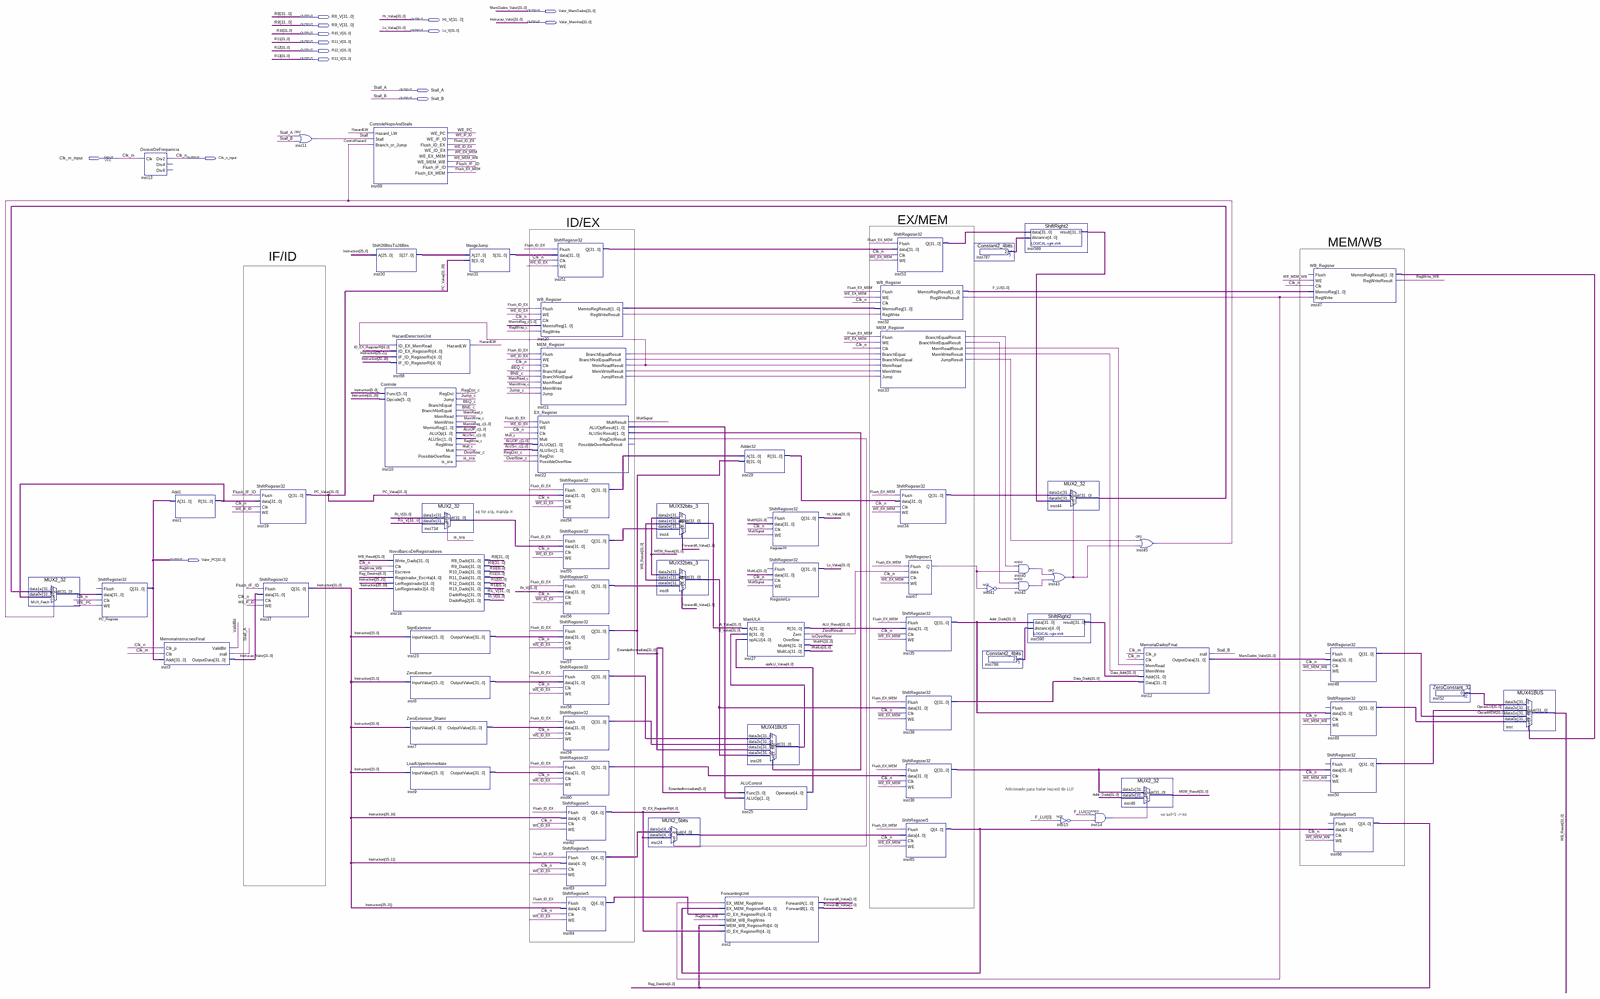
[diagram p0: schematic sheet, whole]
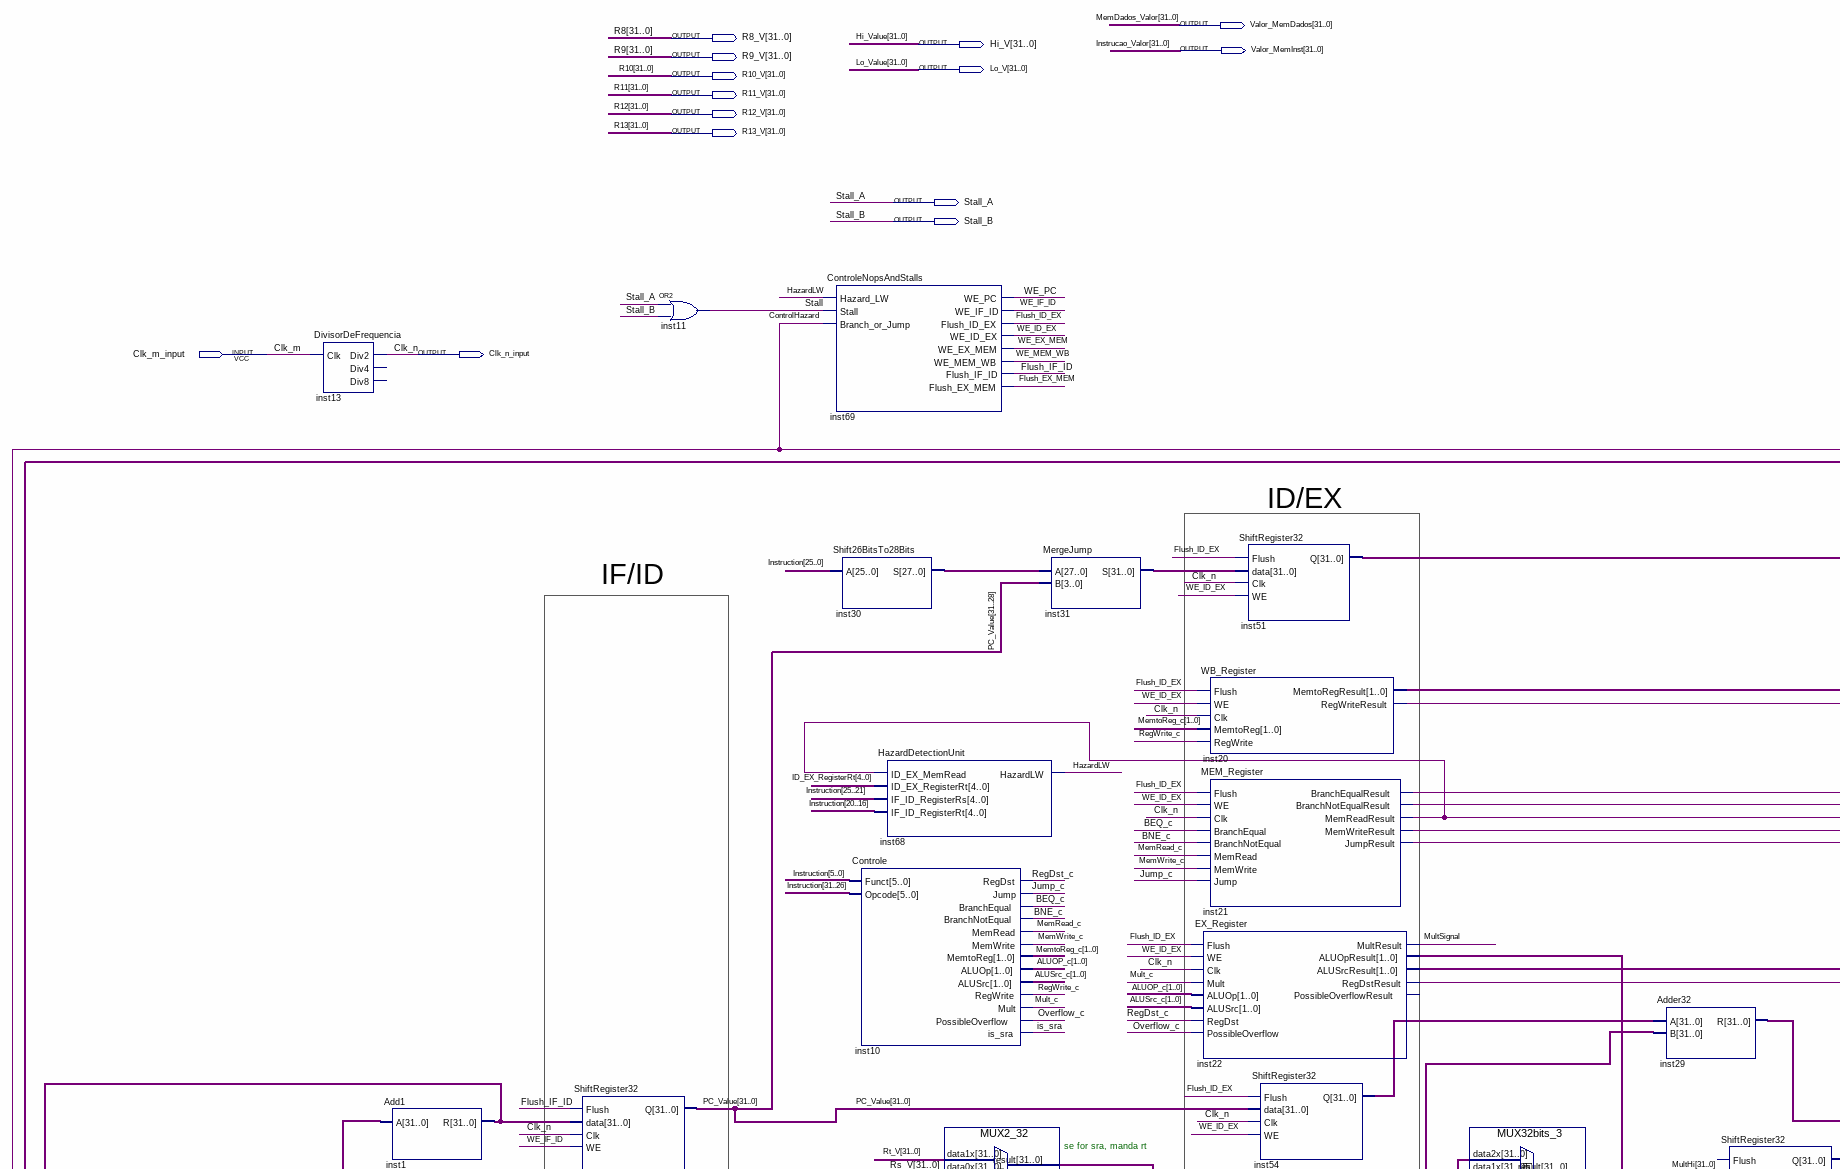
[diagram p1: schematic sheet, upper left part]
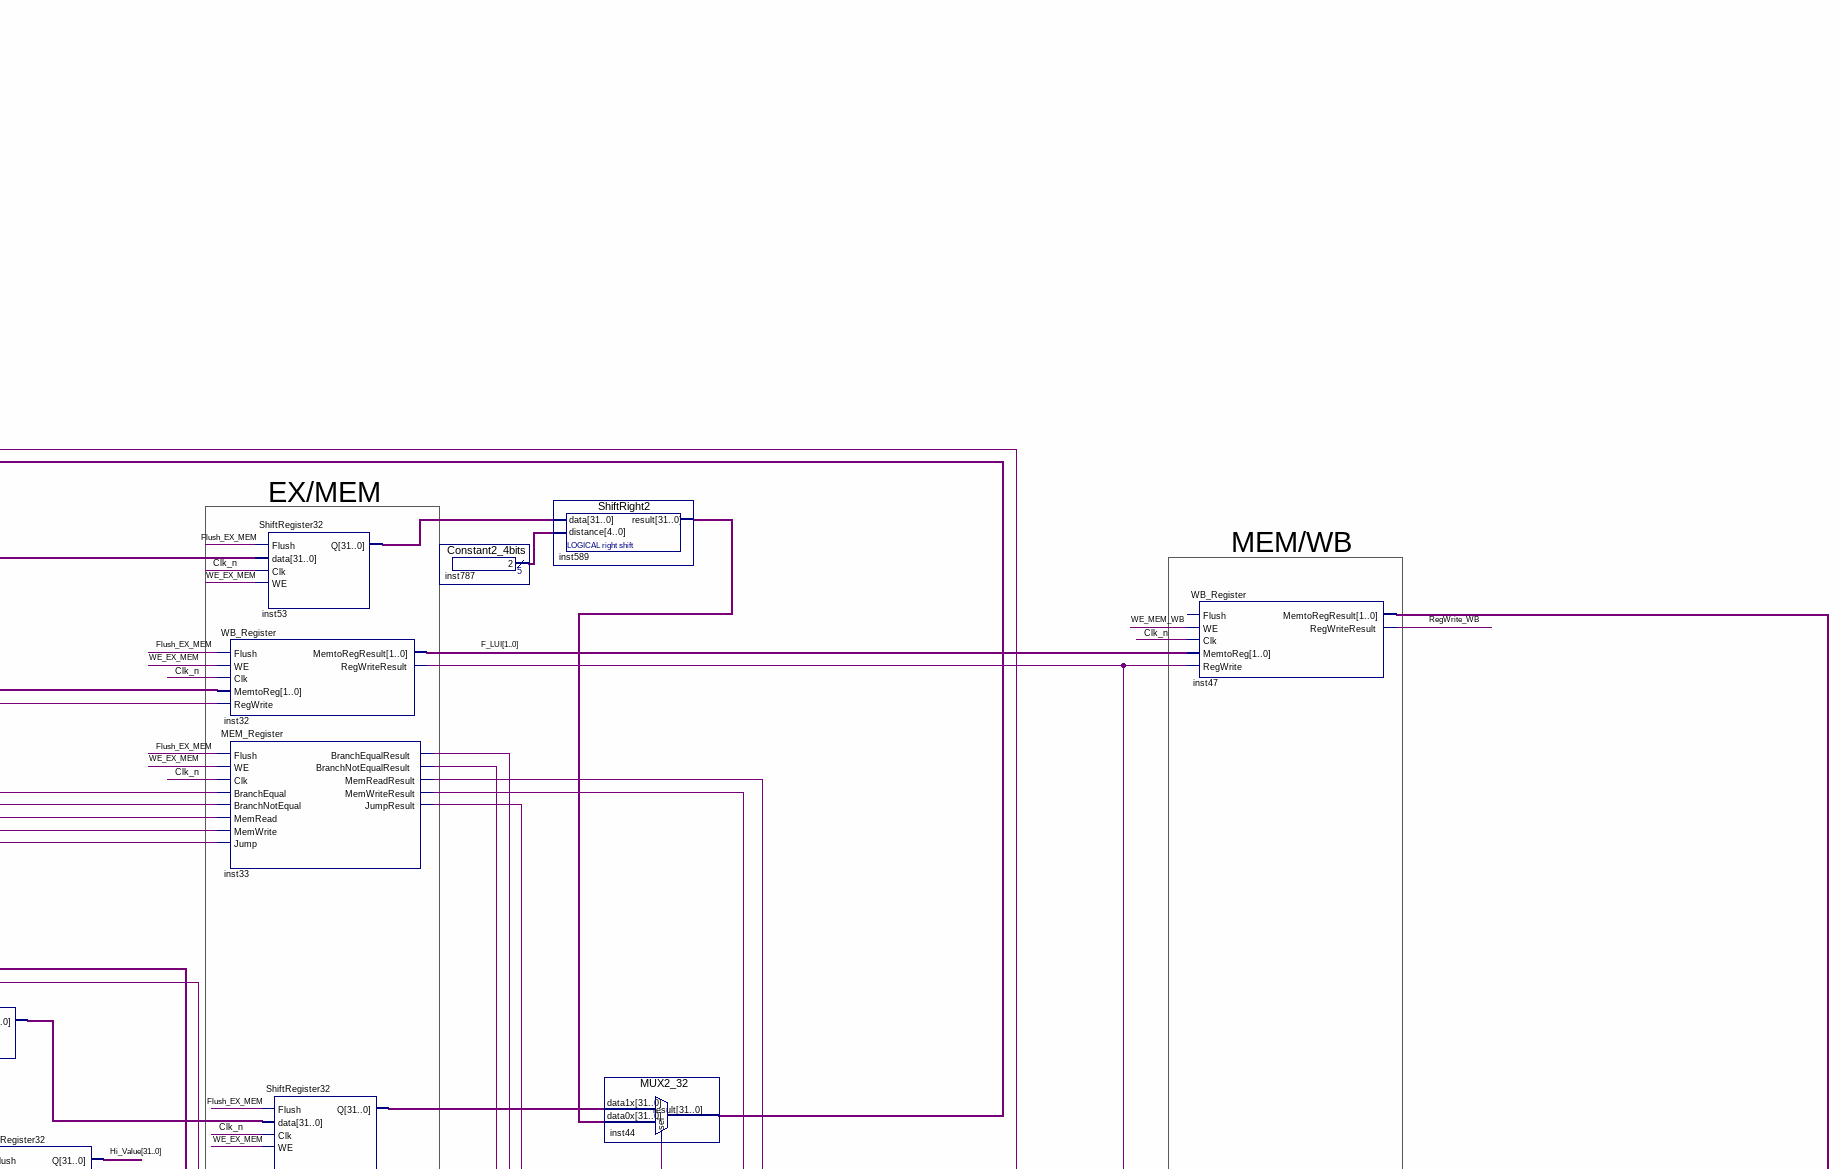
[diagram p2: schematic sheet, upper right part]
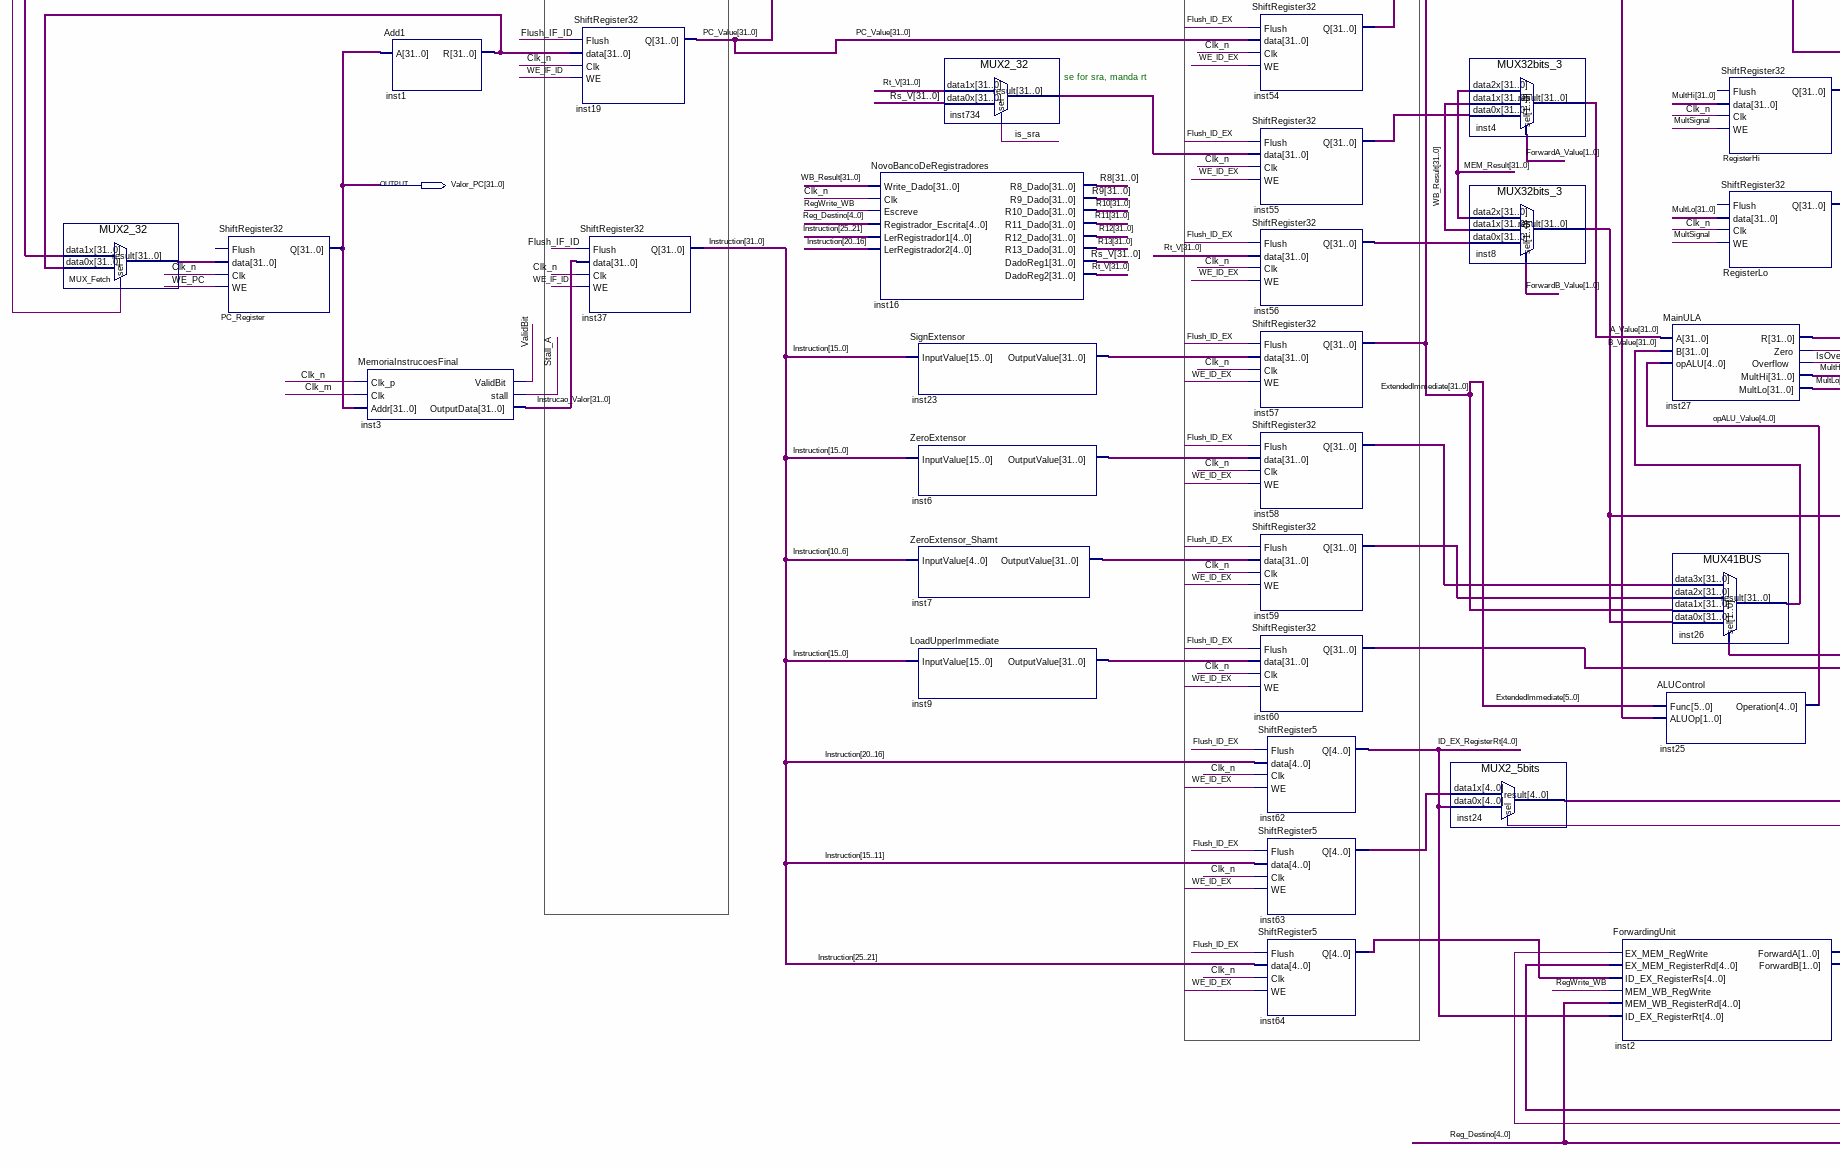
[diagram p3: schematic sheet, lower left part]
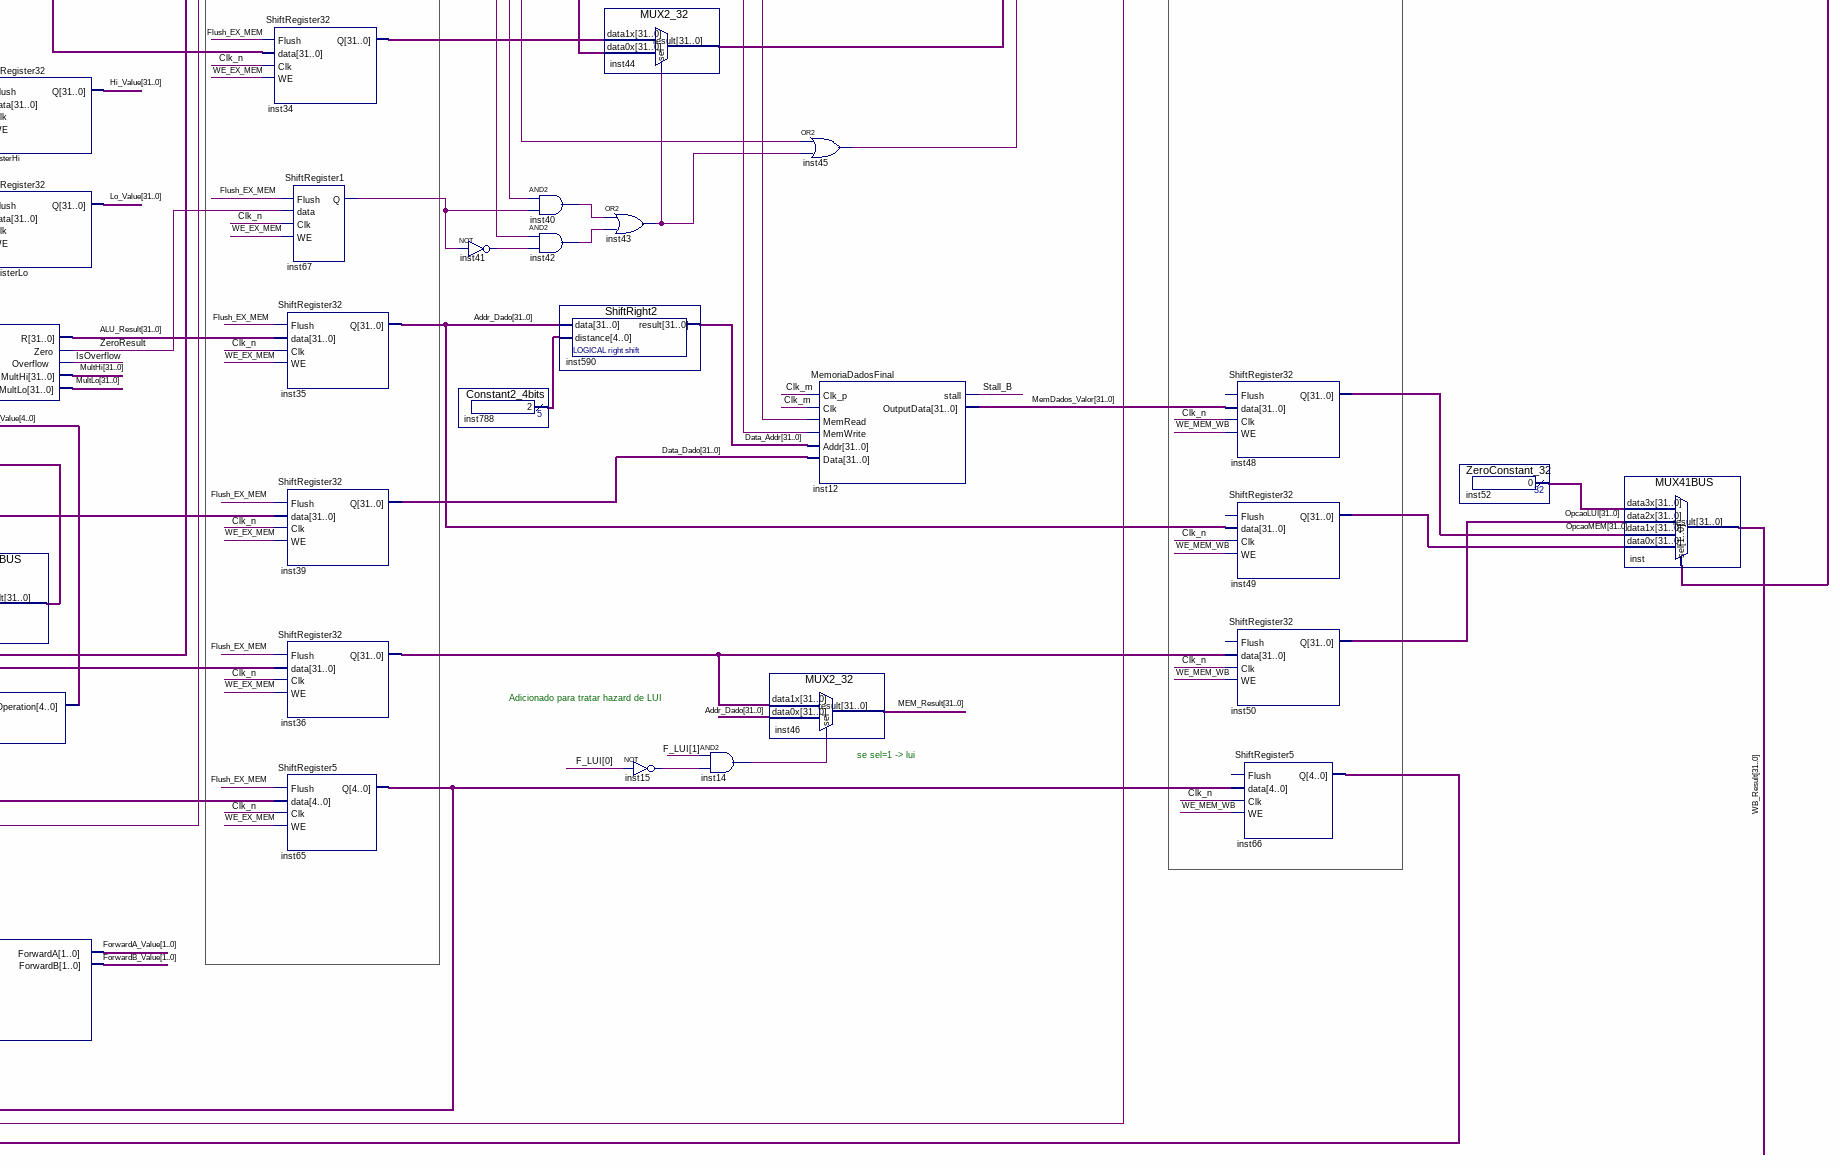
[diagram p4: schematic sheet, lower right part]
// Quartus schematic Processador.bdf as structural Verilog: 73 symbols, 15 pins
module Processador (
  input  Clk_m_input,
  output [31:0] Valor_MemDados,
  output [31:0] R8_V,
  output [31:0] Hi_V,
  output [31:0] Valor_MemInst,
  output [31:0] R9_V,
  output [31:0] Lo_V,
  output [31:0] R10_V,
  output [31:0] R11_V,
  output [31:0] R12_V,
  output [31:0] R13_V,
  output Stall_A,
  output Stall_B,
  output Clk_n_input,
  output [31:0] Valor_PC
);

  wire BEQ_c, BNE_c, ControlHazard, Flush_EX_MEM, Flush_ID_EX, Flush_IF_ID, HazardLW, inst14_out, inst15_out,
       inst20_regwriteresult, inst21_branchequalresult, inst21_branchnotequalresult, inst21_jumpresult,
       inst21_memreadresult, inst21_memwriteresult, inst22_regdstresult, inst32_regwriteresult,
       inst33_branchequalresult, inst33_branchnotequalresult, inst33_jumpresult, inst33_memreadresult,
       inst33_memwriteresult, inst40_out, inst41_out, inst42_out, inst43_out, inst67_q, is_sra, IsOverflow,
       Jump_c, MemRead_c, MemWrite_c, Mult_c, MultSignal, Overflow_c, RegDst_c, RegWrite_c, RegWrite_WB,
       Stall, ValidBit, WE_EX_MEM, WE_ID_EX, WE_IF_ID, WE_MEM_WB, WE_PC, ZeroResult;
  wire [1:0] ALUOP_c, ALUSrc_c, F_LUI, ForwardA_Value, ForwardB_Value, inst20_memtoregresult,
       inst22_aluopresult, inst22_alusrcresult, inst47_memtoregresult, MemtoReg_c;
  wire [4:0] ID_EX_RegisterRt, inst24_result, inst63_q, inst64_q, inst65_q, inst787_result, inst788_result,
       opALU_Value, Reg_Destino;
  wire [27:0] inst30_s;
  wire [31:0] A_Value, Addr_Dado, ALU_Result, B_Value, Data_Addr, Data_Dado, ExtendedImmediate, inst1_r,
       inst6_outputvalue, inst7_outputvalue, inst8_result, inst9_outputvalue, inst23_outputvalue, inst29_r,
       inst31_s, inst34_q, inst36_q, inst44_result, inst49_q, inst51_q, inst52_result, inst53_q, inst54_q,
       inst55_q, inst56_q, inst58_q, inst59_q, inst60_q, inst589_result, inst734_result, Instruction,
       MEM_Result, MultHi, MultLo, MUX_Fetch_result, OpcaoLUI, OpcaoMEM, PC_Value, Rs_V, Rt_V, WB_Result;

  MUX2_32 MUX_Fetch (.data1x(inst44_result), .data0x(inst1_r), .sel(ControlHazard), .result(MUX_Fetch_result));
  ShiftRegister32 PC_Register (.data(MUX_Fetch_result), .Clk(Clk_n_input), .WE(WE_PC), .Q(Valor_PC));  // open: Flush
  DivisorDeFrequencia inst13 (.Clk(Clk_m_input), .Div2(Clk_n_input));  // open: Div4, Div8
  MemoriaInstrucoesFinal inst3 (
    .Clk_p(Clk_n_input), .Clk(Clk_m_input), .Addr(Valor_PC), .ValidBit(ValidBit), .stall(Stall_A),
    .OutputData(Valor_MemInst));
  Add1 inst1 (.A(Valor_PC), .R(inst1_r));
  ShiftRegister32 inst19 (.Flush(Flush_IF_ID), .data(inst1_r), .Clk(Clk_n_input), .WE(WE_IF_ID), .Q(PC_Value));
  ShiftRegister32 inst37 (.Flush(Flush_IF_ID), .data(Valor_MemInst), .Clk(Clk_n_input), .WE(WE_IF_ID), .Q(Instruction));
  or inst11 (Stall, Stall_A, Stall_B);
  ControleNopsAndStalls inst69 (
    .Hazard_LW(HazardLW), .Stall(Stall), .Branch_or_Jump(ControlHazard), .WE_PC(WE_PC), .WE_IF_ID(WE_IF_ID),
    .Flush_ID_EX(Flush_ID_EX), .WE_ID_EX(WE_ID_EX), .WE_EX_MEM(WE_EX_MEM), .WE_MEM_WB(WE_MEM_WB),
    .Flush_IF_ID(Flush_IF_ID), .Flush_EX_MEM(Flush_EX_MEM));
  Shift26BitsTo28Bits inst30 (.A(Instruction[25:0]), .S(inst30_s));
  HazardDetectionUnit inst68 (
    .ID_EX_MemRead(inst21_memreadresult), .ID_EX_RegisterRt(ID_EX_RegisterRt),
    .IF_ID_RegisterRs(Instruction[25:21]), .IF_ID_RegisterRt(Instruction[20:16]), .HazardLW(HazardLW));
  Controle inst10 (
    .Funct(Instruction[5:0]), .Opcode(Instruction[31:26]), .RegDst(RegDst_c), .Jump(Jump_c),
    .BranchEqual(BEQ_c), .BranchNotEqual(BNE_c), .MemRead(MemRead_c), .MemWrite(MemWrite_c),
    .MemtoReg(MemtoReg_c), .ALUOp(ALUOP_c), .ALUSrc(ALUSrc_c), .RegWrite(RegWrite_c), .Mult(Mult_c),
    .PossibleOverflow(Overflow_c), .is_sra(is_sra));
  NovoBancoDeRegistradores inst16 (
    .Write_Dado(WB_Result), .Clk(Clk_n_input), .Escreve(RegWrite_WB), .Registrador_Escrita(Reg_Destino),
    .LerRegistrador1(Instruction[25:21]), .LerRegistrador2(Instruction[20:16]), .R8_Dado(R8_V),
    .R9_Dado(R9_V), .R10_Dado(R10_V), .R11_Dado(R11_V), .R12_Dado(R12_V), .R13_Dado(R13_V), .DadoReg1(Rs_V),
    .DadoReg2(Rt_V));
  SignExtensor inst23 (.InputValue(Instruction[15:0]), .OutputValue(inst23_outputvalue));
  ZeroExtensor inst6 (.InputValue(Instruction[15:0]), .OutputValue(inst6_outputvalue));
  ZeroExtensor_Shamt inst7 (.InputValue(Instruction[10:6]), .OutputValue(inst7_outputvalue));
  LoadUpperImmediate inst9 (.InputValue(Instruction[15:0]), .OutputValue(inst9_outputvalue));
  MUX2_32 inst734 (.data1x(Rt_V), .data0x(Rs_V), .sel(is_sra), .result(inst734_result));
  MergeJump inst31 (.A(inst30_s), .B(PC_Value[31:28]), .S(inst31_s));
  ShiftRegister32 inst51 (.Flush(Flush_ID_EX), .data(inst31_s), .Clk(Clk_n_input), .WE(WE_ID_EX), .Q(inst51_q));
  WB_Register inst20 (
    .Flush(Flush_ID_EX), .WE(WE_ID_EX), .Clk(Clk_n_input), .MemtoReg(MemtoReg_c), .RegWrite(RegWrite_c),
    .MemtoRegResult(inst20_memtoregresult), .RegWriteResult(inst20_regwriteresult));
  MEM_Register inst21 (
    .Flush(Flush_ID_EX), .WE(WE_ID_EX), .Clk(Clk_n_input), .BranchEqual(BEQ_c), .BranchNotEqual(BNE_c),
    .MemRead(MemRead_c), .MemWrite(MemWrite_c), .Jump(Jump_c), .BranchEqualResult(inst21_branchequalresult),
    .BranchNotEqualResult(inst21_branchnotequalresult), .MemReadResult(inst21_memreadresult),
    .MemWriteResult(inst21_memwriteresult), .JumpResult(inst21_jumpresult));
  EX_Register inst22 (
    .Flush(Flush_ID_EX), .WE(WE_ID_EX), .Clk(Clk_n_input), .Mult(Mult_c), .ALUOp(ALUOP_c), .ALUSrc(ALUSrc_c),
    .RegDst(RegDst_c), .PossibleOverflow(Overflow_c), .MultResult(MultSignal),
    .ALUOpResult(inst22_aluopresult), .ALUSrcResult(inst22_alusrcresult), .RegDstResult(inst22_regdstresult));  // open: PossibleOverflowResult
  ShiftRegister32 inst54 (.Flush(Flush_ID_EX), .data(PC_Value), .Clk(Clk_n_input), .WE(WE_ID_EX), .Q(inst54_q));
  ShiftRegister32 inst55 (.Flush(Flush_ID_EX), .data(inst734_result), .Clk(Clk_n_input), .WE(WE_ID_EX), .Q(inst55_q));
  ShiftRegister32 inst56 (.Flush(Flush_ID_EX), .data(Rt_V), .Clk(Clk_n_input), .WE(WE_ID_EX), .Q(inst56_q));
  ShiftRegister32 inst57 (
    .Flush(Flush_ID_EX), .data(inst23_outputvalue), .Clk(Clk_n_input), .WE(WE_ID_EX), .Q(ExtendedImmediate));
  ShiftRegister32 inst58 (
    .Flush(Flush_ID_EX), .data(inst6_outputvalue), .Clk(Clk_n_input), .WE(WE_ID_EX), .Q(inst58_q));
  ShiftRegister32 inst59 (
    .Flush(Flush_ID_EX), .data(inst7_outputvalue), .Clk(Clk_n_input), .WE(WE_ID_EX), .Q(inst59_q));
  ShiftRegister32 inst60 (
    .Flush(Flush_ID_EX), .data(inst9_outputvalue), .Clk(Clk_n_input), .WE(WE_ID_EX), .Q(inst60_q));
  ShiftRegister5 inst62 (
    .Flush(Flush_ID_EX), .data(Instruction[20:16]), .Clk(Clk_n_input), .WE(WE_ID_EX), .Q(ID_EX_RegisterRt));
  ShiftRegister5 inst63 (
    .Flush(Flush_ID_EX), .data(Instruction[15:11]), .Clk(Clk_n_input), .WE(WE_ID_EX), .Q(inst63_q));
  ShiftRegister5 inst64 (
    .Flush(Flush_ID_EX), .data(Instruction[25:21]), .Clk(Clk_n_input), .WE(WE_ID_EX), .Q(inst64_q));
  MUX32bits_3 inst4 (
    .data2x(MEM_Result), .data1x(WB_Result), .data0x(inst55_q), .sel(ForwardA_Value), .result(A_Value));
  MUX32bits_3 inst8 (
    .data2x(MEM_Result), .data1x(WB_Result), .data0x(inst56_q), .sel(ForwardB_Value), .result(inst8_result));
  MUX2_5bits inst24 (.data1x(inst63_q), .data0x(ID_EX_RegisterRt), .sel(inst22_regdstresult), .result(inst24_result));
  ForwardingUnit inst2 (
    .EX_MEM_RegWrite(inst32_regwriteresult), .EX_MEM_RegisterRd(inst65_q), .ID_EX_RegisterRs(inst64_q),
    .MEM_WB_RegWrite(RegWrite_WB), .MEM_WB_RegisterRd(Reg_Destino), .ID_EX_RegisterRt(ID_EX_RegisterRt),
    .ForwardA(ForwardA_Value), .ForwardB(ForwardB_Value));
  Adder32 inst29 (.A(inst54_q), .B(ExtendedImmediate), .R(inst29_r));
  MainULA inst27 (
    .A(A_Value), .B(B_Value), .opALU(opALU_Value), .R(ALU_Result), .Zero(ZeroResult), .Overflow(IsOverflow),
    .MultHi(MultHi), .MultLo(MultLo));
  MUX41BUS inst26 (
    .data3x(inst58_q), .data2x(inst59_q), .data1x(ExtendedImmediate), .data0x(inst8_result),
    .sel(inst22_alusrcresult), .result(B_Value));
  ALUControl inst25 (.Func(ExtendedImmediate[5:0]), .ALUOp(inst22_aluopresult), .Operation(opALU_Value));
  ShiftRegister32 RegisterHi (.data(MultHi), .Clk(Clk_n_input), .WE(MultSignal), .Q(Hi_V));  // open: Flush
  ShiftRegister32 RegisterLo (.data(MultLo), .Clk(Clk_n_input), .WE(MultSignal), .Q(Lo_V));  // open: Flush
  ShiftRegister32 inst53 (.Flush(Flush_EX_MEM), .data(inst51_q), .Clk(Clk_n_input), .WE(WE_EX_MEM), .Q(inst53_q));
  WB_Register inst32 (
    .Flush(Flush_EX_MEM), .WE(WE_EX_MEM), .Clk(Clk_n_input), .MemtoReg(inst20_memtoregresult),
    .RegWrite(inst20_regwriteresult), .MemtoRegResult(F_LUI), .RegWriteResult(inst32_regwriteresult));
  MEM_Register inst33 (
    .Flush(Flush_EX_MEM), .WE(WE_EX_MEM), .Clk(Clk_n_input), .BranchEqual(inst21_branchequalresult),
    .BranchNotEqual(inst21_branchnotequalresult), .MemRead(inst21_memreadresult),
    .MemWrite(inst21_memwriteresult), .Jump(inst21_jumpresult), .BranchEqualResult(inst33_branchequalresult),
    .BranchNotEqualResult(inst33_branchnotequalresult), .MemReadResult(inst33_memreadresult),
    .MemWriteResult(inst33_memwriteresult), .JumpResult(inst33_jumpresult));
  ShiftRegister32 inst34 (.Flush(Flush_EX_MEM), .data(inst29_r), .Clk(Clk_n_input), .WE(WE_EX_MEM), .Q(inst34_q));
  ShiftRegister1 inst67 (.Flush(Flush_EX_MEM), .data(ZeroResult), .Clk(Clk_n_input), .WE(WE_EX_MEM), .Q(inst67_q));
  ShiftRegister32 inst35 (.Flush(Flush_EX_MEM), .data(ALU_Result), .Clk(Clk_n_input), .WE(WE_EX_MEM), .Q(Addr_Dado));
  ShiftRegister32 inst39 (.Flush(Flush_EX_MEM), .data(inst8_result), .Clk(Clk_n_input), .WE(WE_EX_MEM), .Q(Data_Dado));
  ShiftRegister32 inst36 (.Flush(Flush_EX_MEM), .data(inst60_q), .Clk(Clk_n_input), .WE(WE_EX_MEM), .Q(inst36_q));
  ShiftRegister5 inst65 (.Flush(Flush_EX_MEM), .data(inst24_result), .Clk(Clk_n_input), .WE(WE_EX_MEM), .Q(inst65_q));
  Constant2_4bits inst787 (.result(inst787_result));
  not inst41 (inst41_out, inst67_q);
  Constant2_4bits inst788 (.result(inst788_result));
  ShiftRight2 inst589 (.data(inst53_q), .distance(inst787_result), .result(inst589_result));
  and inst40 (inst40_out, inst33_branchequalresult, inst67_q);
  and inst42 (inst42_out, inst33_branchnotequalresult, inst41_out);
  ShiftRight2 inst590 (.data(Addr_Dado), .distance(inst788_result), .result(Data_Addr));
  MUX2_32 inst44 (.data1x(inst34_q), .data0x(inst589_result), .sel(inst43_out), .result(inst44_result));
  or inst43 (inst43_out, inst40_out, inst42_out);
  not inst15 (inst15_out, F_LUI[0]);
  and inst14 (inst14_out, F_LUI[1], inst15_out);
  or inst45 (ControlHazard, inst33_jumpresult, inst43_out);
  MemoriaDadosFinal inst12 (
    .Clk_p(Clk_m_input), .Clk(Clk_m_input), .MemRead(inst33_memreadresult), .MemWrite(inst33_memwriteresult),
    .Addr(Data_Addr), .Data(Data_Dado), .stall(Stall_B), .OutputData(Valor_MemDados));
  MUX2_32 inst46 (.data1x(inst36_q), .data0x(Addr_Dado), .sel(inst14_out), .result(MEM_Result));
  WB_Register inst47 (
    .WE(WE_MEM_WB), .Clk(Clk_n_input), .MemtoReg(F_LUI), .RegWrite(inst32_regwriteresult),
    .MemtoRegResult(inst47_memtoregresult), .RegWriteResult(RegWrite_WB));  // open: Flush
  ShiftRegister32 inst48 (.data(Valor_MemDados), .Clk(Clk_n_input), .WE(WE_MEM_WB), .Q(OpcaoMEM));  // open: Flush
  ShiftRegister32 inst49 (.data(Addr_Dado), .Clk(Clk_n_input), .WE(WE_MEM_WB), .Q(inst49_q));  // open: Flush
  ShiftRegister32 inst50 (.data(inst36_q), .Clk(Clk_n_input), .WE(WE_MEM_WB), .Q(OpcaoLUI));  // open: Flush
  ShiftRegister5 inst66 (.data(inst65_q), .Clk(Clk_n_input), .WE(WE_MEM_WB), .Q(Reg_Destino));  // open: Flush
  ZeroConstant_32 inst52 (.result(inst52_result));
  MUX41BUS inst (
    .data3x(inst52_result), .data2x(OpcaoLUI), .data1x(OpcaoMEM), .data0x(inst49_q),
    .sel(inst47_memtoregresult), .result(WB_Result));

  // Other names for the same wires on the sheet: Clk_m = Clk_m_input; Clk_n = Clk_n_input; Hi_Value[31:0] = Hi_V;
  //   Instrucao_Valor[31:0] = Valor_MemInst; Lo_Value[31:0] = Lo_V; MemDados_Valor[31:0] = Valor_MemDados;
  //   R8[31:0] = R8_V; R9[31:0] = R9_V; R10[31:0] = R10_V; R11[31:0] = R11_V; R12[31:0] = R12_V; R13[31:0] = R13_V

  // Notes on the sheet:
  //   EX/MEM
  //   ID/EX
  //   MEM/WB
  //   IF/ID
  //   se for sra, manda rt
  //   Adicionado para tratar hazard de LUI
  //   se sel=1 -> lui
endmodule
